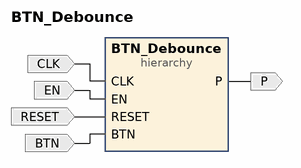
[diagram p0: block diagram of the top level]
# Vivado block design BTN_Debounce, xc7a35tcpg236-1, Vivado 2018.3
create_bd_design BTN_Debounce

create_bd_port -dir I CLK
create_bd_port -dir I EN
create_bd_port -dir I BTN
create_bd_port -dir I RESET
create_bd_port -dir O P

create_bd_cell -type hier BTN_Debounce

# ---- hierarchy /BTN_Debounce ----
current_bd_instance /BTN_Debounce
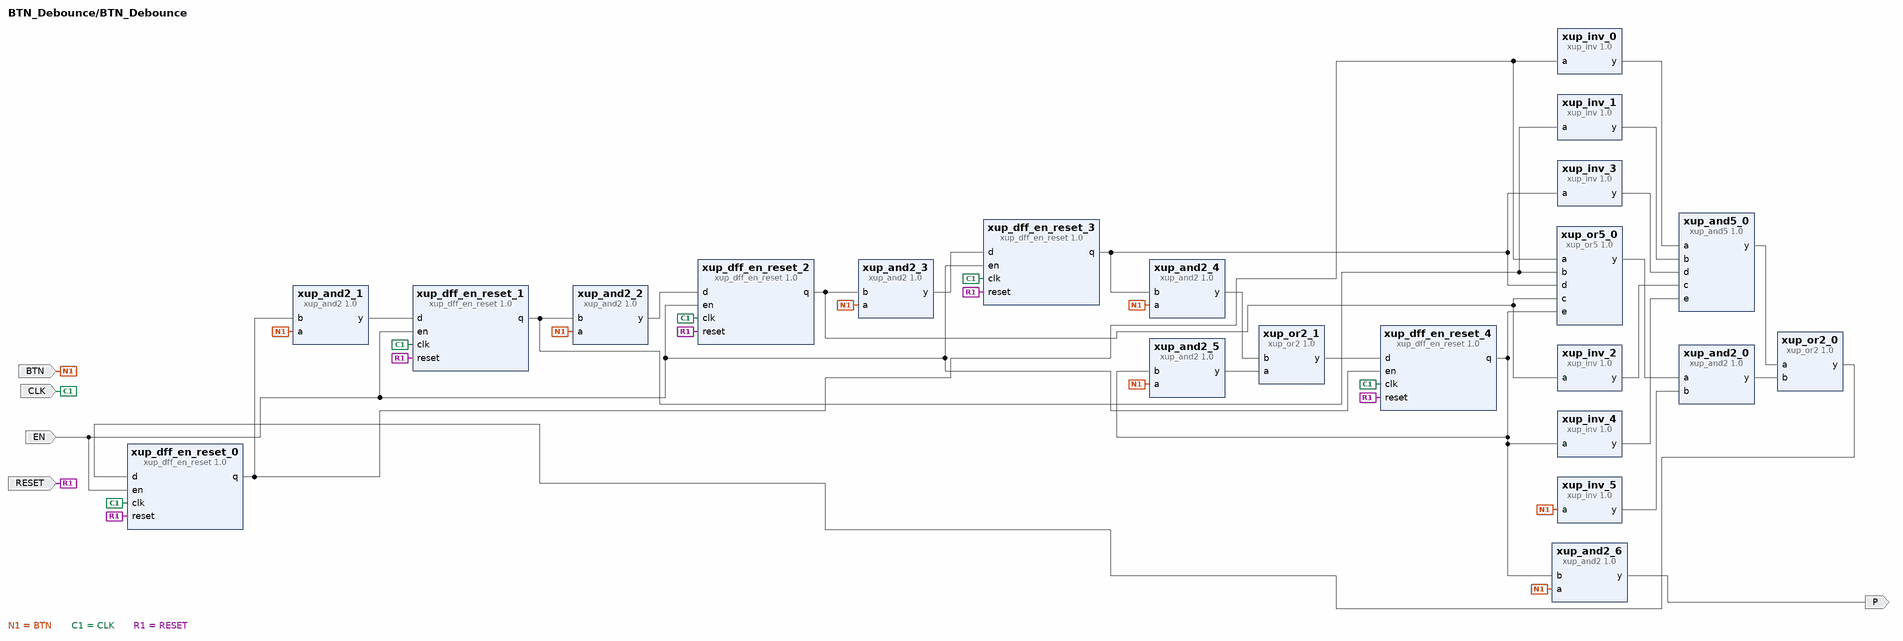
[diagram p1: block diagram inside /BTN_Debounce]
create_bd_pin -dir I BTN
create_bd_pin -dir I CLK
create_bd_pin -dir I EN
create_bd_pin -dir I RESET
create_bd_pin -dir O P

create_bd_cell -type ip -vlnv xilinx.com:xup:xup_or2:1.0 xup_or2_1
set_property -dict {CONFIG.DELAY 0} [get_bd_cells xup_or2_1]
create_bd_cell -type ip -vlnv xilinx.com:xup:xup_and2:1.0 xup_and2_4
set_property -dict {CONFIG.DELAY 0} [get_bd_cells xup_and2_4]
create_bd_cell -type ip -vlnv xilinx.com:xup:xup_or5:1.0 xup_or5_0
set_property -dict {CONFIG.DELAY 0} [get_bd_cells xup_or5_0]
create_bd_cell -type ip -vlnv xilinx.com:xup:xup_and2:1.0 xup_and2_5
set_property -dict {CONFIG.DELAY 0} [get_bd_cells xup_and2_5]
create_bd_cell -type ip -vlnv xilinx.com:xup:xup_dff_en_reset:1.0 xup_dff_en_reset_0
set_property -dict {CONFIG.DELAY 0} [get_bd_cells xup_dff_en_reset_0]
create_bd_cell -type ip -vlnv xilinx.com:xup:xup_and2:1.0 xup_and2_6
set_property -dict {CONFIG.DELAY 0} [get_bd_cells xup_and2_6]
create_bd_cell -type ip -vlnv xilinx.com:xup:xup_dff_en_reset:1.0 xup_dff_en_reset_1
set_property -dict {CONFIG.DELAY 0} [get_bd_cells xup_dff_en_reset_1]
create_bd_cell -type ip -vlnv xilinx.com:xup:xup_dff_en_reset:1.0 xup_dff_en_reset_2
set_property -dict {CONFIG.DELAY 0} [get_bd_cells xup_dff_en_reset_2]
create_bd_cell -type ip -vlnv xilinx.com:xup:xup_dff_en_reset:1.0 xup_dff_en_reset_3
set_property -dict {CONFIG.DELAY 0} [get_bd_cells xup_dff_en_reset_3]
create_bd_cell -type ip -vlnv xilinx.com:xup:xup_dff_en_reset:1.0 xup_dff_en_reset_4
set_property -dict {CONFIG.DELAY 0} [get_bd_cells xup_dff_en_reset_4]
create_bd_cell -type ip -vlnv xilinx.com:xup:xup_inv:1.0 xup_inv_0
set_property -dict {CONFIG.DELAY 0} [get_bd_cells xup_inv_0]
create_bd_cell -type ip -vlnv xilinx.com:xup:xup_inv:1.0 xup_inv_1
set_property -dict {CONFIG.DELAY 0} [get_bd_cells xup_inv_1]
create_bd_cell -type ip -vlnv xilinx.com:xup:xup_inv:1.0 xup_inv_2
set_property -dict {CONFIG.DELAY 0} [get_bd_cells xup_inv_2]
create_bd_cell -type ip -vlnv xilinx.com:xup:xup_and2:1.0 xup_and2_0
set_property -dict {CONFIG.DELAY 0} [get_bd_cells xup_and2_0]
create_bd_cell -type ip -vlnv xilinx.com:xup:xup_inv:1.0 xup_inv_3
set_property -dict {CONFIG.DELAY 0} [get_bd_cells xup_inv_3]
create_bd_cell -type ip -vlnv xilinx.com:xup:xup_and2:1.0 xup_and2_1
set_property -dict {CONFIG.DELAY 0} [get_bd_cells xup_and2_1]
create_bd_cell -type ip -vlnv xilinx.com:xup:xup_inv:1.0 xup_inv_4
set_property -dict {CONFIG.DELAY 0} [get_bd_cells xup_inv_4]
create_bd_cell -type ip -vlnv xilinx.com:xup:xup_inv:1.0 xup_inv_5
set_property -dict {CONFIG.DELAY 0} [get_bd_cells xup_inv_5]
create_bd_cell -type ip -vlnv xilinx.com:xup:xup_and2:1.0 xup_and2_2
set_property -dict {CONFIG.DELAY 0} [get_bd_cells xup_and2_2]
create_bd_cell -type ip -vlnv xilinx.com:xup:xup_and5:1.0 xup_and5_0
set_property -dict {CONFIG.DELAY 0} [get_bd_cells xup_and5_0]
create_bd_cell -type ip -vlnv xilinx.com:xup:xup_or2:1.0 xup_or2_0
set_property -dict {CONFIG.DELAY 0} [get_bd_cells xup_or2_0]
create_bd_cell -type ip -vlnv xilinx.com:xup:xup_and2:1.0 xup_and2_3
set_property -dict {CONFIG.DELAY 0} [get_bd_cells xup_and2_3]

# ---- connections ----

current_bd_instance /BTN_Debounce
connect_bd_net [get_bd_pins xup_and2_5/y] [get_bd_pins xup_or2_1/a]
connect_bd_net [get_bd_pins xup_and2_4/y] [get_bd_pins xup_or2_1/b]
connect_bd_net [get_bd_pins xup_or2_1/y] [get_bd_pins xup_dff_en_reset_4/d]
connect_bd_net [get_bd_pins xup_dff_en_reset_3/q] [get_bd_pins xup_inv_3/a] [get_bd_pins xup_or5_0/d] [get_bd_pins xup_and2_4/b]
connect_bd_net [get_bd_pins xup_dff_en_reset_0/q] [get_bd_pins xup_inv_0/a] [get_bd_pins xup_or5_0/a] [get_bd_pins xup_and2_1/b]
connect_bd_net [get_bd_pins xup_dff_en_reset_1/q] [get_bd_pins xup_inv_1/a] [get_bd_pins xup_or5_0/b] [get_bd_pins xup_and2_2/b]
connect_bd_net [get_bd_pins xup_dff_en_reset_2/q] [get_bd_pins xup_inv_2/a] [get_bd_pins xup_or5_0/c] [get_bd_pins xup_and2_3/b]
connect_bd_net [get_bd_pins xup_dff_en_reset_4/q] \
  [get_bd_pins xup_inv_4/a] [get_bd_pins xup_or5_0/e] [get_bd_pins xup_and2_6/b] [get_bd_pins xup_and2_5/b]
connect_bd_net [get_bd_pins xup_or5_0/y] [get_bd_pins xup_and2_0/a]
connect_bd_net [get_bd_pins xup_or2_0/y] [get_bd_pins xup_dff_en_reset_0/d]
connect_bd_net [get_bd_pins xup_and2_1/y] [get_bd_pins xup_dff_en_reset_1/d]
connect_bd_net [get_bd_pins xup_and2_2/y] [get_bd_pins xup_dff_en_reset_2/d]
connect_bd_net [get_bd_pins xup_and2_3/y] [get_bd_pins xup_dff_en_reset_3/d]
connect_bd_net [get_bd_pins xup_inv_0/y] [get_bd_pins xup_and5_0/a]
connect_bd_net [get_bd_pins xup_inv_1/y] [get_bd_pins xup_and5_0/b]
connect_bd_net [get_bd_pins xup_inv_2/y] [get_bd_pins xup_and5_0/c]
connect_bd_net [get_bd_pins xup_inv_5/y] [get_bd_pins xup_and2_0/b]
connect_bd_net [get_bd_pins xup_and2_0/y] [get_bd_pins xup_or2_0/b]
connect_bd_net [get_bd_pins xup_inv_3/y] [get_bd_pins xup_and5_0/d]
connect_bd_net [get_bd_pins xup_inv_4/y] [get_bd_pins xup_and5_0/e]
connect_bd_net [get_bd_pins xup_and5_0/y] [get_bd_pins xup_or2_0/a]
connect_bd_net [get_bd_pins BTN] \
  [get_bd_pins xup_inv_5/a] [get_bd_pins xup_and2_6/a] [get_bd_pins xup_and2_1/a] [get_bd_pins xup_and2_2/a] \
  [get_bd_pins xup_and2_3/a] [get_bd_pins xup_and2_5/a] [get_bd_pins xup_and2_4/a]
connect_bd_net [get_bd_pins CLK] \
  [get_bd_pins xup_dff_en_reset_1/clk] [get_bd_pins xup_dff_en_reset_2/clk] [get_bd_pins xup_dff_en_reset_3/clk] \
  [get_bd_pins xup_dff_en_reset_4/clk] [get_bd_pins xup_dff_en_reset_0/clk]
connect_bd_net [get_bd_pins EN] \
  [get_bd_pins xup_dff_en_reset_1/en] [get_bd_pins xup_dff_en_reset_2/en] [get_bd_pins xup_dff_en_reset_3/en] \
  [get_bd_pins xup_dff_en_reset_4/en] [get_bd_pins xup_dff_en_reset_0/en]
connect_bd_net [get_bd_pins RESET] \
  [get_bd_pins xup_dff_en_reset_1/reset] [get_bd_pins xup_dff_en_reset_2/reset] [get_bd_pins xup_dff_en_reset_3/reset] \
  [get_bd_pins xup_dff_en_reset_4/reset] [get_bd_pins xup_dff_en_reset_0/reset]
connect_bd_net [get_bd_pins xup_and2_6/y] [get_bd_pins P]

current_bd_instance /
connect_bd_net [get_bd_ports CLK] [get_bd_pins BTN_Debounce/CLK]
connect_bd_net [get_bd_ports EN] [get_bd_pins BTN_Debounce/EN]
connect_bd_net [get_bd_ports RESET] [get_bd_pins BTN_Debounce/RESET]
connect_bd_net [get_bd_ports BTN] [get_bd_pins BTN_Debounce/BTN]
connect_bd_net -net xup_and2_6_y [get_bd_pins BTN_Debounce/P] [get_bd_ports P]

validate_bd_design
save_bd_design
